# Altium schematic sheet Mainboard_LoRa   MCU SCH.SchDoc
size A4
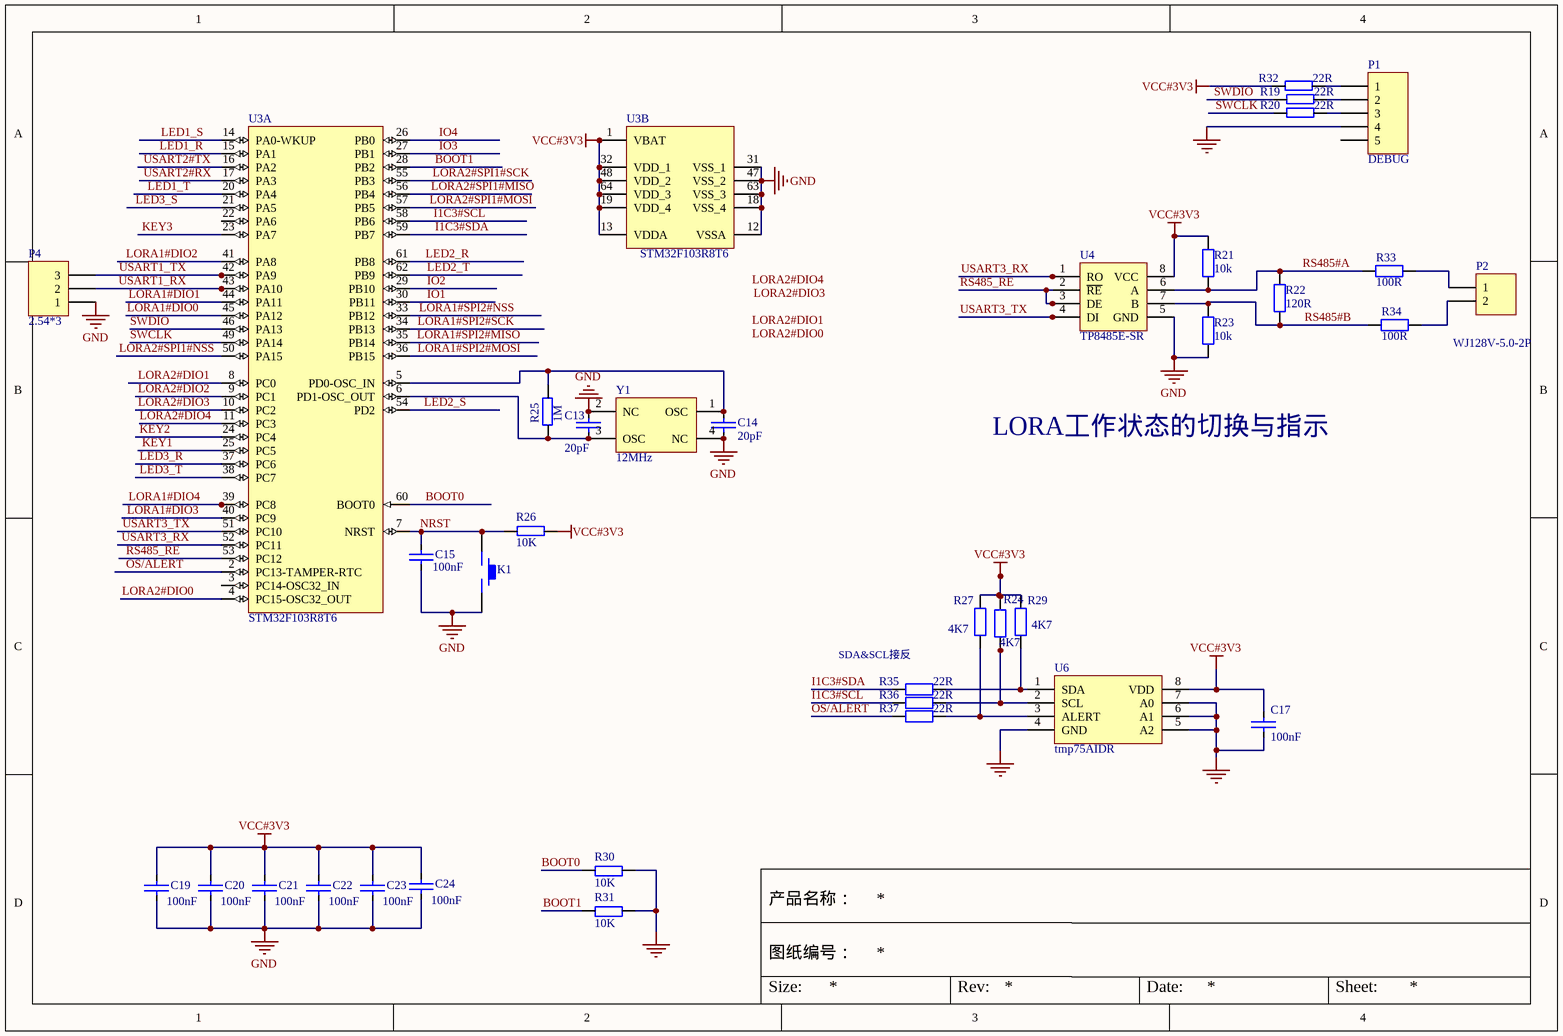
[diagram p0: Mainboard_LoRa   MCU SCH.SchDoc]

## Parts
C13  20pF  [CAPC_0603_2]
C14  20pF  [CAPC_0603_2]
C15  100nF  [CAPC_0603_2]
C17  100nF  [CAPC_0603_2]
C19  100nF  [CAPC_0603_2]
C20  100nF  [CAPC_0603_2]
C21  100nF  [CAPC_0603_2]
C22  100nF  [CAPC_0603_2]
C23  100nF  [CAPC_0603_2]
C24  100nF  [CAPC_0603_2]
K1  K2-1102SP-E4SC-04  [SW_PB_SMD_6X6]  (value not drawn)
P1  DEBUG  [Header 2.54X5]
P2  WJ128V-5.0-2P  [KF128_2P]
P4  2.54*3  [Header 2.54X3]
R19  22R  [RESC_0603_2]
R20  22R  [RESC_0603_2]
R21  10k  [RESC_0603_2]
R22  120R  [RESC_0603_2]
R23  10k  [RESC_0603_2]
R24  4K7  [RESC_0603_2]
R25  1M  [RESC_0603_2]
R26  10K  [RESC_0603_2]
R27  4K7  [RESC_0603_2]
R29  4K7  [RESC_0603_2]
R30  10K  [RESC_0603_2]
R31  10K  [RESC_0603_2]
R32  22R  [RESC_0603_2]
R33  100R  [RESC_0603_2]
R34  100R  [RESC_0603_2]
R35  22R  [RESC_0603_2]
R36  22R  [RESC_0603_2]
R37  22R  [RESC_0603_2]
U3  STM32F103R8T6  [STM-LQFP64_N]  (parts A,B of 2)
U4  TP8485E-SR  [SOIC_8]
U6  tmp75AIDR  [SOIC_8]
Y1  12MHz  [xt3225]

## Nets
GND: C13.1 C14.2 C15.1 C17.2 C19.1 C20.1 C21.1 C22.1 C23.1 C24.1 K1.2 P1.4 P4.1 R23.1 R30.2 R31.2 U3.12(VSSA) U3.18(VSS_4) U3.31(VSS_1) U3.47(VSS_2) U3.63(VSS_3) U4.5(GND) U6.4(GND) U6.5(A2) U6.6(A1) U6.7(A0) Y1.2(NC) Y1.4(NC)
VCC#3V3: C17.1 C19.2 C20.2 C21.2 C22.2 C23.2 C24.2 R21.2 R24.2 R26.1 R27.2 R29.2 R32.2 U3.1(VBAT) U3.13(VDDA) U3.19(VDD_4) U3.32(VDD_1) U3.48(VDD_2) U3.64(VDD_3) U4.8(VCC) U6.8(VDD)
BOOT0: R30.1 U3.60(BOOT0)
BOOT1: R31.1 U3.28(PB2)
I1C3#SCL: R36.1 U3.58(PB6)
I1C3#SDA: R35.1 U3.59(PB7)
IO1: U3.30(PB11)
IO2: U3.29(PB10)
IO3: U3.27(PB1)
IO4: U3.26(PB0)
KEY1: U3.25(PC5)
KEY2: U3.24(PC4)
KEY3: U3.23(PA7)
LED1_R: U3.15(PA1)
LED1_S: U3.14(PA0-WKUP)
LED1_T: U3.20(PA4)
LED2_R: U3.61(PB8)
LED2_S: U3.54(PD2)
LED2_T: U3.62(PB9)
LED3_R: U3.37(PC6)
LED3_S: U3.21(PA5)
LED3_T: U3.38(PC7)
LORA1#DIO0: U3.45(PA12)
LORA1#DIO1: U3.44(PA11)
LORA1#DIO2: U3.41(PA8)
LORA1#DIO3: U3.40(PC9)
LORA1#DIO4: U3.39(PC8)
LORA1#SPI2#MISO: U3.35(PB14)
LORA1#SPI2#MOSI: U3.36(PB15)
LORA1#SPI2#NSS: U3.33(PB12)
LORA1#SPI2#SCK: U3.34(PB13)
LORA2#DIO0: U3.4(PC15-OSC32_OUT)
LORA2#DIO1: U3.8(PC0)
LORA2#DIO2: U3.9(PC1)
LORA2#DIO3: U3.10(PC2)
LORA2#DIO4: U3.11(PC3)
LORA2#SPI1#MISO: U3.56(PB4)
LORA2#SPI1#MOSI: U3.57(PB5)
LORA2#SPI1#NSS: U3.50(PA15)
LORA2#SPI1#SCK: U3.55(PB3)
NRST: C15.2 K1.1 R26.2 U3.7(NRST)
OS/ALERT: R37.1 U3.2(PC13-TAMPER-RTC)
RS485#A: R21.1 R22.2 R33.2 U4.6(A)
RS485#B: R22.1 R23.2 R34.2 U4.7(B)
RS485_RE: U3.53(PC12) U4.2(~{RE}) U4.3(DE)
SWCLK: R20.2 U3.49(PA14)
SWDIO: R19.2 U3.46(PA13)
USART1_RX: P4.2 U3.43(PA10)
USART1_TX: P4.3 U3.42(PA9)
USART2#RX: U3.17(PA3)
USART2#TX: U3.16(PA2)
USART3_RX: U3.52(PC11) U4.1(RO)
USART3_TX: U3.51(PC10) U4.4(DI)
NetC13_2: C13.2 R25.2 U3.6(PD1-OSC_OUT) Y1.3(OSC)
NetC14_1: C14.1 R25.1 U3.5(PD0-OSC_IN) Y1.1(OSC)
NetP1_1: P1.1 R32.1
NetP1_2: P1.2 R19.1
NetP1_3: P1.3 R20.1
NetP2_1: P2.1 R33.1
NetP2_2: P2.2 R34.1
NetR24_1: R24.1 R36.2 U6.2(SCL)
NetR27_1: R27.1 R37.2 U6.3(ALERT)
NetR29_1: R29.1 R35.2 U6.1(SDA)

Not connected (* = marked no-connect by the designer): P1 5; U3 3(PC14-OSC32_IN) 22(PA6)

## Notes on the sheet
- LORA工作状态的切换与指示
- SDA&SCL接反
- Labels drawn without touching a wire or pin: LORA2#DIO0, LORA2#DIO1, LORA2#DIO3, LORA2#DIO4
- 产品名称：
- 图纸编号：
- Size:
- Rev:
- Date:
- Sheet:

## Library data of the parts
C13-C15 C17 C19-C24 = C: 无极性电容
K1 = KEY_M
P1 = Header 5: Header, 5-Pin; LatestRevisionDate: 17-Jul-2002; LatestRevisionNote: Re-released for DXP Platform.; Publisher: Altium Limited
P2 = Header 2H: Header, 2-Pin, Right Angle; LatestRevisionDate: 17-Jul-2002; LatestRevisionNote: Re-released for DXP Platform.; Publisher: Altium Limited
P4 = Header 3H: Header, 3-Pin, Right Angle; LatestRevisionDate: 17-Jul-2002; LatestRevisionNote: Re-released for DXP Platform.; Publisher: Altium Limited
R19 R20 R25 R26 R30-R32 = R
R21-R24 R27 R29 R33-R37 = R: Resistor; Published: 8-Jun-2000; LatestRevisionDate: 17-Jul-2002; LatestRevisionNote: Re-released for DXP Platform.; PackageReference: AXIAL-0.4; Publisher: Altium Limited; PackageDescription: Axial Device, Thru-Hole; 2 Leads; 0.4 in Pin Spacing
U3 = STM32F103R8T6: ARM Cortex-M3 32-bit MCU, 64 KB Flash, 20 KB Internal RAM, 51 I/Os, 64-pin LQFP, -40 to 85 degC, Tray; A/D Converter: 2x12-bit (16 Channel); FLASH Size (Prog) (kB): 64; I/Os (High Current): 51; Internal RAM Size (kB): 20; Operating Frequency(F) (Processor speed) (MHz): 72; Supply Voltage(Vcc) min (V): 2; DatasheetVersion: Rev. 16; PackageVersion: Rev. 4, 06/2013; PackageReference: LQFP64; PackageDescription: 64-Pin Low Profile Quad Flat Package, 10 x 10 mm Body, 0.5 mm Pitch; Supplier 1: Digi-Key; Supplier Part Number 1: 497-6065-ND; Supplier 2: Farnell; Supplier Part Number 2: 1447638; Supplier 3: Newark; Supplier Part Number 3: 57P1241; Supplier 4: Mouser; Supplier Part Number 4: 511-STM32F103R8T6; Core: ARM Cortex-M3; Packing: Tray; Mounting Technology: Surface Mount; PartNumber: STM32F103R8T6; ComponentLink1Description: Manufacturer URL; ComponentLink1URL: http://www.st.com/web/en/home.html; ComponentLink2Description: Datasheet; ComponentLink2URL: http://www.st.com/st-web-ui/static/active/en/resource/technical/document/datasheet/CD00161566.pdf; ComponentLink3Description: Package Specification; ComponentLink3URL: http://www.st.com/st-web-ui/static/active/en/resource/technical/document/datasheet/DM00037051.pdf
U4 = SP485
Y1 = XTAL-WY